# Altium schematic sheet ISO_UARTc.SchDoc
size 420 x 297 mm; SheetNumber: 8; SheetTotal: 7
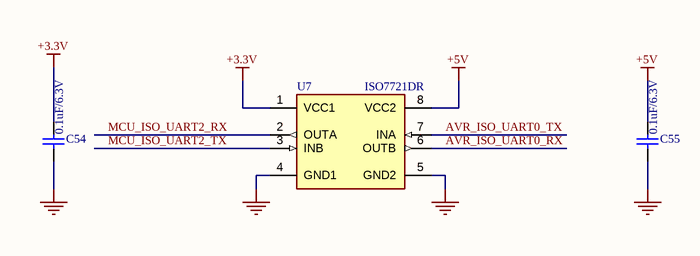
[diagram p0: ISO_UARTc.SchDoc]

## Parts
C54  0.1uF/6.3V  [CAP_C_1608X80]
C55  0.1uF/6.3V  [CAP_C_1608X80]
U7  ISO7721DR  [SOIC127P602X173-8N]

## Nets
+3.3V: C54.1 U7.1(VCC1)
+5V: C55.1 U7.8(VCC2)
GND: C54.2 C55.2 U7.4(GND1) U7.5(GND2)
AVR_ISO_UART0_RX: U7.6(OUTB)
AVR_ISO_UART0_TX: U7.7(INA)
MCU_ISO_UART2_RX: U7.2(OUTA)
MCU_ISO_UART2_TX: U7.3(INB)

## Notes on the sheet
- Sub-system:
- Project:
- Design by:
- Sheet title:
- Sheet
- of
- Checked by:
- Approved by:
- Doc No:
- Revision:
- Size:
- Date:
- A3

## Library data of the parts
C54 C55 = Tu 0402 33nF 10V: CAPC; Chung_Loai: Dán; Don_Vi: Con; So_Chan: 2; Ten_Linh_Kien: Tụ 0402 33nF X7R 10V GRM155R71A333KA01D; Ma_Hang: MH007853; Kieu_Chan: *
U7 = ISO7721DR: Robust EMC, dual-channel, 1/1, reinforced digital isolator 8-SOIC -55 to 125; Package: None; Value: *; MP: ISO7721DR; Availability: Unavailable; Price: None